# EasyEDA schematic SCH_PCB-micropad_2024-07-04.json
TITLE: Sheet_1; REV: 1.0; Date: 2024-07-03; Sheet: 1/1; Drawn By: projachmann; Company: Your Company
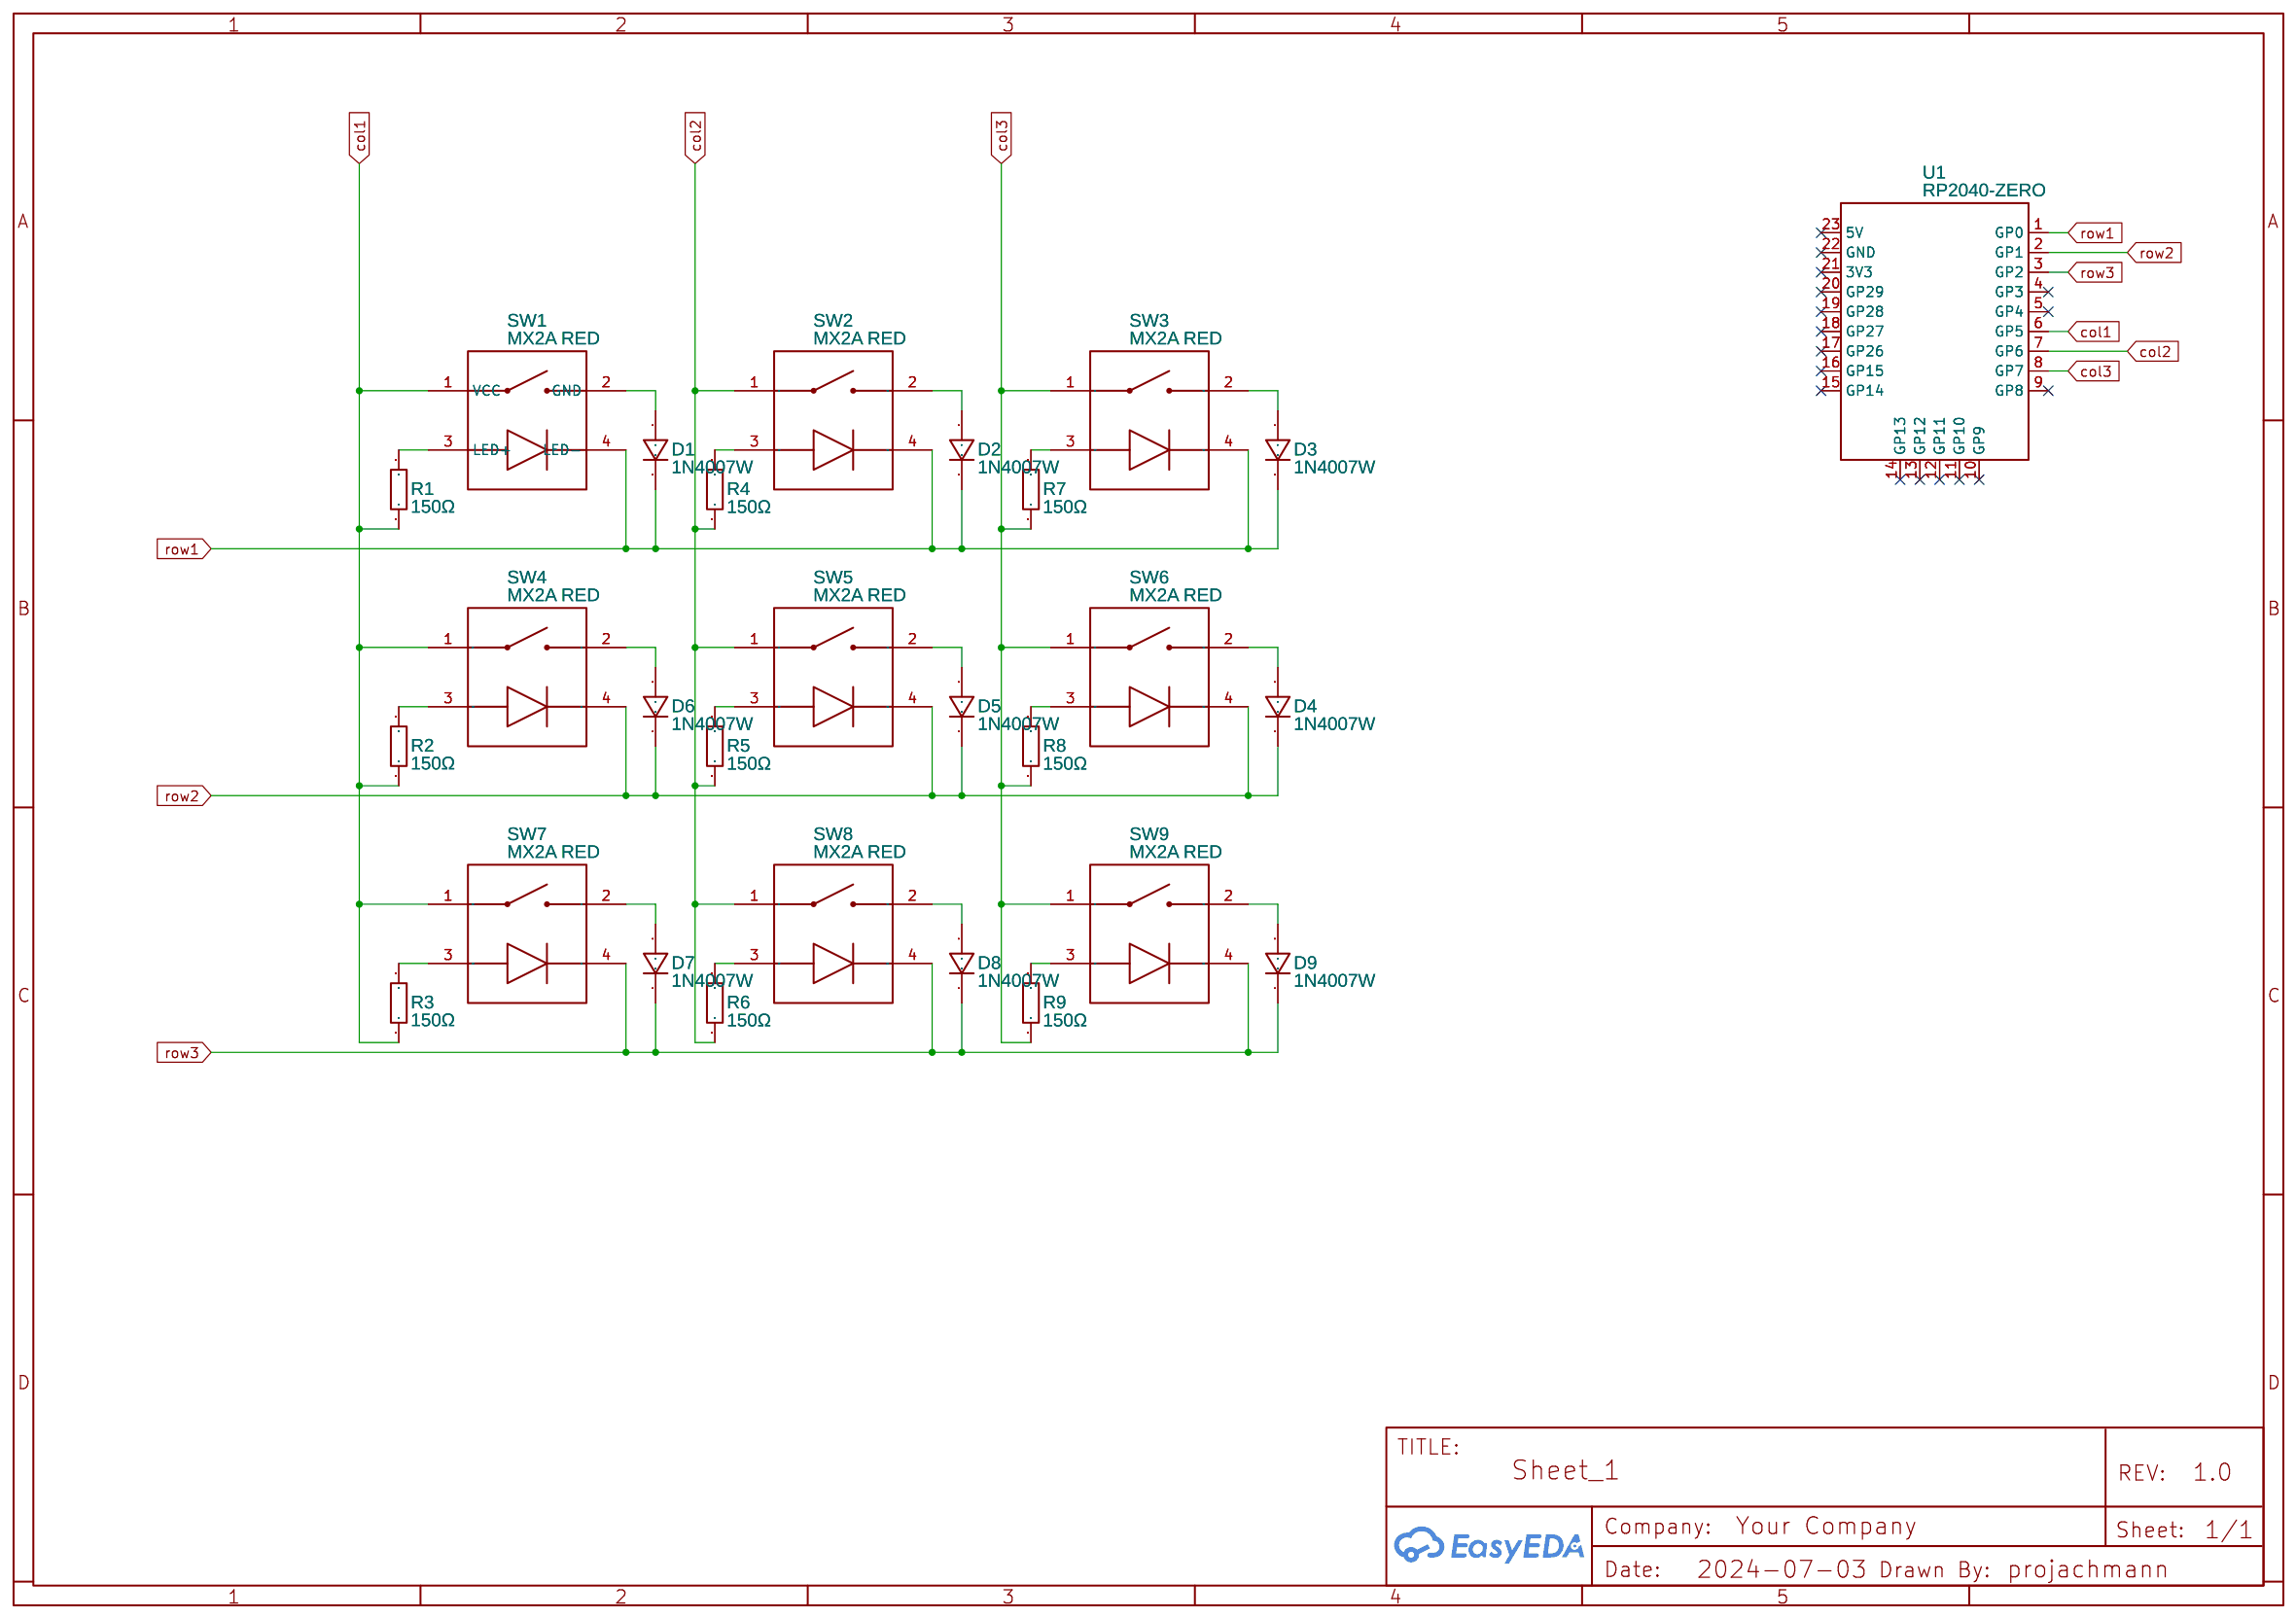
[diagram p0: schematic sheet]

## Parts
D1  1N4007W  [SOD-123_L2.8-W1.8-LS3.7-RD]
D2  1N4007W  [SOD-123_L2.8-W1.8-LS3.7-RD]
D3  1N4007W  [SOD-123_L2.8-W1.8-LS3.7-RD]
D4  1N4007W  [SOD-123_L2.8-W1.8-LS3.7-RD]
D5  1N4007W  [SOD-123_L2.8-W1.8-LS3.7-RD]
D6  1N4007W  [SOD-123_L2.8-W1.8-LS3.7-RD]
D7  1N4007W  [SOD-123_L2.8-W1.8-LS3.7-RD]
D8  1N4007W  [SOD-123_L2.8-W1.8-LS3.7-RD]
D9  1N4007W  [SOD-123_L2.8-W1.8-LS3.7-RD]
R1  150Ω  [RES-TH_BD3.3-L9.0-P13.00-D0.6]
R2  150Ω  [RES-TH_BD3.3-L9.0-P13.00-D0.6]
R3  150Ω  [RES-TH_BD3.3-L9.0-P13.00-D0.6]
R4  150Ω  [RES-TH_BD3.3-L9.0-P13.00-D0.6]
R5  150Ω  [RES-TH_BD3.3-L9.0-P13.00-D0.6]
R6  150Ω  [RES-TH_BD3.3-L9.0-P13.00-D0.6]
R7  150Ω  [RES-TH_BD3.3-L9.0-P13.00-D0.6]
R8  150Ω  [RES-TH_BD3.3-L9.0-P13.00-D0.6]
R9  150Ω  [RES-TH_BD3.3-L9.0-P13.00-D0.6]
SW1  MX2A RED  [MX2A-L1NB]
SW2  MX2A RED  [MX2A-L1NB]
SW3  MX2A RED  [MX2A-L1NB]
SW4  MX2A RED  [MX2A-L1NB]
SW5  MX2A RED  [MX2A-L1NB]
SW6  MX2A RED  [MX2A-L1NB]
SW7  MX2A RED  [MX2A-L1NB]
SW8  MX2A RED  [MX2A-L1NB]
SW9  MX2A RED  [MX2A-L1NB]
U1  RP2040-ZERO  [COMM-SMD_RP2040-ZERO]

## Library data of the parts
D1-D9 = 1N4007W: Supplier: LCSC; Supplier Part: C328592; Manufacturer: BLUE ROCKET; Contributor: LCEDA_Lib
R1-R9 = MFR1WSFTE52-150R: Contributor: LCSC; Supplier: LCSC; Supplier Part: C172921; Manufacturer: YAGEO(国巨); JLCPCB Part Class: Extended Part
SW1-SW9 = MX2A RED: Manufacturer: Cherry; Supplier: Digi-Key; Supplier Part: 1644-MX2A-L1NB-ND; link: https://www.cherryamericas.com/mx2a-red; Contributor: the_basketcase
U1 = RP2040-ZERO: Supplier: LCSC; Supplier Part: C5350143; Manufacturer: Waveshare(微雪电子); Manufacturer Part: RP2040-Zero; JLCPCB Part Class: Extended Part; Contributor: lcsc

## Nets
col1: R1.1 R2.1 R3.1 SW1.1(VCC) SW4.1(VCC) SW7.1(VCC) U1.6(GP5)
col2: R4.1 R5.1 R6.1 SW2.1(VCC) SW5.1(VCC) SW8.1(VCC) U1.7(GP6)
col3: R7.1 R8.1 R9.1 SW3.1(VCC) SW6.1(VCC) SW9.1(VCC) U1.8(GP7)
row1: D1.1 D2.1 D3.1 SW1.4(LED-) SW2.4(LED-) SW3.4(LED-) U1.1(GP0)
row2: D4.1 D5.1 D6.1 SW4.4(LED-) SW5.4(LED-) SW6.4(LED-) U1.2(GP1)
row3: D7.1 D8.1 D9.1 SW7.4(LED-) SW8.4(LED-) SW9.4(LED-) U1.3(GP2)
Net-(D1-2): D1.2 SW1.2(GND)
Net-(D2-2): D2.2 SW2.2(GND)
Net-(D3-2): D3.2 SW3.2(GND)
Net-(D4-2): D4.2 SW6.2(GND)
Net-(D5-2): D5.2 SW5.2(GND)
Net-(D6-2): D6.2 SW4.2(GND)
Net-(D7-2): D7.2 SW7.2(GND)
Net-(D8-2): D8.2 SW8.2(GND)
Net-(D9-2): D9.2 SW9.2(GND)
Net-(R1-2): R1.2 SW1.3(LED+)
Net-(R2-2): R2.2 SW4.3(LED+)
Net-(R3-2): R3.2 SW7.3(LED+)
Net-(R4-2): R4.2 SW2.3(LED+)
Net-(R5-2): R5.2 SW5.3(LED+)
Net-(R6-2): R6.2 SW8.3(LED+)
Net-(R7-2): R7.2 SW3.3(LED+)
Net-(R8-2): R8.2 SW6.3(LED+)
Net-(R9-2): R9.2 SW9.3(LED+)

Not connected (* = marked no-connect by the designer): U1 4(GP3)* 5(GP4)* 9(GP8)* 10(GP9)* 11(GP10)* 12(GP11)* 13(GP12)* 14(GP13)* 15(GP14)* 16(GP15)* 17(GP26)* 18(GP27)* 19(GP28)* 20(GP29)* 21(3V3)* 22(GND)* 23(5V)*
